# Altium schematic sheet ADC.SchDoc
size A4; SheetNumber: 13; SheetTotal: 20
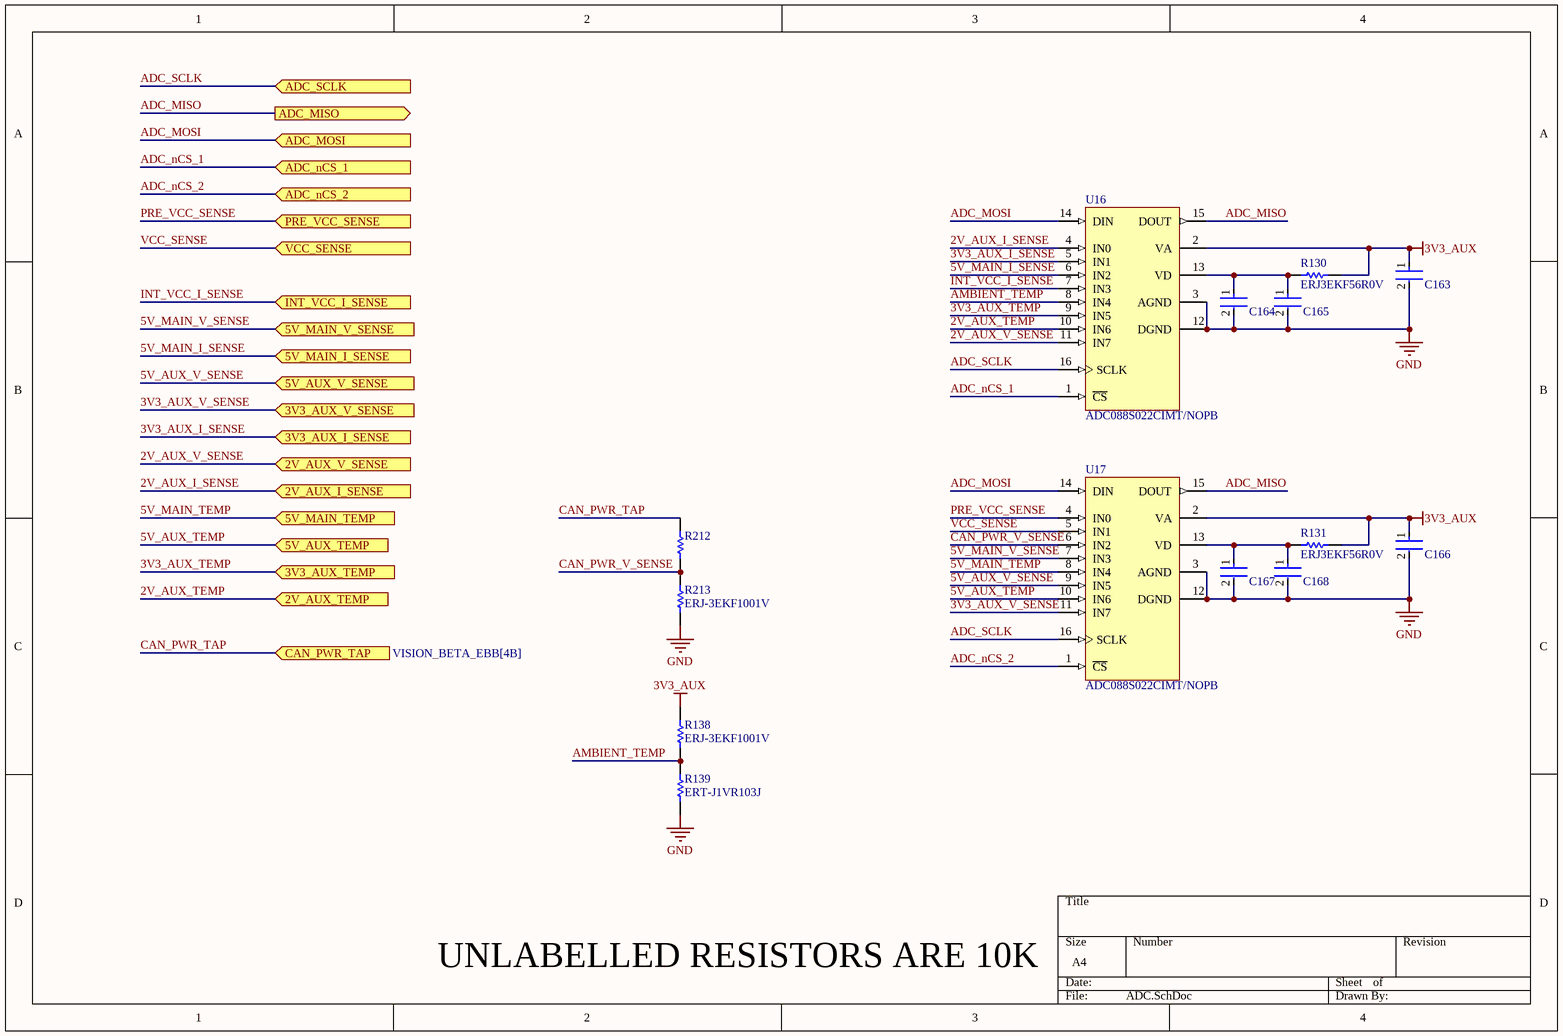
[diagram p0: ADC.SchDoc]

## Parts
C163  C0402C104K8PACTU  [FP-C0402-BB-MFG]  (value not drawn)
C164  C0402C104K8PACTU  [FP-C0402-BB-MFG]  (value not drawn)
C165  C0402C104K8PACTU  [FP-C0402-BB-MFG]  (value not drawn)
C166  C0402C104K8PACTU  [FP-C0402-BB-MFG]  (value not drawn)
C167  C0402C104K8PACTU  [FP-C0402-BB-MFG]  (value not drawn)
C168  C0402C104K8PACTU  [FP-C0402-BB-MFG]  (value not drawn)
R130  ERJ3EKF56R0V  [RESC1608X55X30NL15T15]
R131  ERJ3EKF56R0V  [RESC1608X55X30NL15T15]
R138  ERJ-3EKF1001V  [RESC1608X55X30LL15T15]
R139  ERT-J1VR103J  [RESC1608X90X30ML15T20]
R212  ERJ3EKF1002V  [RESC1609X55X30LL15T15]  (value not drawn)
R213  ERJ-3EKF1001V  [RESC1608X55X30LL15T15]
U16  ADC088S022CIMT/NOPB  [MTC16_L]
U17  ADC088S022CIMT/NOPB  [MTC16_L]

## Ports
2V_AUX_I_SENSE (in, see VISION_BETA_EBB[4B], PWR_MGMT[6A]), 2V_AUX_TEMP (in, see VISION_BETA_EBB[4B]), 2V_AUX_V_SENSE (in, see VISION_BETA_EBB[4B]), 3V3_AUX_I_SENSE (in, see VISION_BETA_EBB[4B], PWR_MGMT[6A]), 3V3_AUX_TEMP (in, see VISION_BETA_EBB[4B]), 3V3_AUX_V_SENSE (in, see VISION_BETA_EBB[4B]), 5V_AUX_TEMP (in, see VISION_BETA_EBB[4A]), 5V_AUX_V_SENSE (in, see VISION_BETA_EBB[4A]), 5V_MAIN_I_SENSE (in, see VISION_BETA_EBB[4B], PWR_MGMT[6A]), 5V_MAIN_TEMP (in, see VISION_BETA_EBB[4A]), 5V_MAIN_V_SENSE (in, see VISION_BETA_EBB[4A]), ADC_MISO (out, see VISION_BETA_EBB[5A]), ADC_MOSI (in, see VISION_BETA_EBB[5A]), ADC_nCS_1 (in, see VISION_BETA_EBB[5A]), ADC_nCS_2 (in, see VISION_BETA_EBB[5A]), ADC_SCLK (in, see VISION_BETA_EBB[5A]), CAN_PWR_TAP (in, see VISION_BETA_EBB[4B]), INT_VCC_I_SENSE (in, see VISION_BETA_EBB[4B], PWR_MGMT[6A]), PRE_VCC_SENSE (in, see VISION_BETA_EBB[4B], PWR_MGMT[6A]), VCC_SENSE (in, see VISION_BETA_EBB[4B], PWR_MGMT[6A])

## Nets
3V3_AUX: C163.1 C166.1 R130.1 R131.1 R138.2 U16.2(VA) U17.2(VA)
GND: C163.2 C164.2 C165.2 C166.2 C167.2 C168.2 R139.1 R213.1 U16.3(AGND) U16.12(DGND) U17.3(AGND) U17.12(DGND)
2V_AUX_I_SENSE: U16.4(IN0) ; port 2V_AUX_I_SENSE
2V_AUX_TEMP: U16.10(IN6) ; port 2V_AUX_TEMP
2V_AUX_V_SENSE: U16.11(IN7) ; port 2V_AUX_V_SENSE
3V3_AUX_I_SENSE: U16.5(IN1) ; port 3V3_AUX_I_SENSE
3V3_AUX_TEMP: U16.9(IN5) ; port 3V3_AUX_TEMP
3V3_AUX_V_SENSE: U17.11(IN7) ; port 3V3_AUX_V_SENSE
5V_AUX_TEMP: U17.10(IN6) ; port 5V_AUX_TEMP
5V_AUX_V_SENSE: U17.9(IN5) ; port 5V_AUX_V_SENSE
5V_MAIN_I_SENSE: U16.6(IN2) ; port 5V_MAIN_I_SENSE
5V_MAIN_TEMP: U17.8(IN4) ; port 5V_MAIN_TEMP
5V_MAIN_V_SENSE: U17.7(IN3) ; port 5V_MAIN_V_SENSE
ADC_MISO: U16.15(DOUT) U17.15(DOUT) ; port ADC_MISO
ADC_MOSI: U16.14(DIN) U17.14(DIN) ; port ADC_MOSI
ADC_nCS_1: U16.1(~{CS}) ; port ADC_nCS_1
ADC_nCS_2: U17.1(~{CS}) ; port ADC_nCS_2
ADC_SCLK: U16.16(SCLK) U17.16(SCLK) ; port ADC_SCLK
AMBIENT_TEMP: R138.1 R139.2 U16.8(IN4)
CAN_PWR_TAP: R212.2 ; port CAN_PWR_TAP
CAN_PWR_V_SENSE: R212.1 R213.2 U17.6(IN2)
INT_VCC_I_SENSE: U16.7(IN3) ; port INT_VCC_I_SENSE
PRE_VCC_SENSE: U17.4(IN0) ; port PRE_VCC_SENSE
VCC_SENSE: U17.5(IN1) ; port VCC_SENSE
NetC164_1: C164.1 C165.1 R130.2 U16.13(VD)
NetC167_1: C167.1 C168.1 R131.2 U17.13(VD)

## Notes on the sheet
- UNLABELLED RESISTORS ARE 10K

## Library data of the parts
C163-C168 = CMP-2008-02046-2: CAP CER 0.1UF 10V X5R 0402; Manufacturer: Kemet; Material: Ceramic; Capacitance: 0.10 μF; Temperature Coefficient: 15%; Tolerance: 0.1; Value: 0.10 μF; Package: C0402-BB; Temperature: -55°C to +125°C; ComponentLink2Description: Datasheet; Temperature Characteristic: X5R; Device Class L1: Passive Components; Height: 0.55mm; Lead Free: Yes; ComponentLink2URL: https://content.kemet.com/datasheets/KEM_C1002_X7R_SMD.pdf; Device Class L2: Capacitors; Temperature Range Low: -55°C; Temperature Range High: +125°C; RoHS: TRUE; Octopart: https://octopart.com/c0402c104k8pactu-kemet-140039; Automotive: No; Mouser Description: Capacitor 100 nF 10 VDC 0402; Category: Cap; Voltage Rating: 10 V; Digikey Description: CAP CER 0.1UF 10V X5R 0402; Ipc Land Pattern Name: CAPC10050X50; Device Class L3: Ceramic Capacitors; Manufacturer Part Number: C0402C104K8PACTU
R130 R131 = CMP-2000-00572-1: Manufacturer: Panasonic; Part Number: ERJ3EKF56R0V
R138 R213 = CMP-2000-00180-1: Manufacturer: Panasonic; Part Number: ERJ-3EKF1001V
R139 = CMP-2000-00869-1: Manufacturer: Panasonic; Part Number: ERT-J1VR103J
R212 = CMP-1012-00623-3: Chip Resistor, 10 KOhm, +/- 1%, 0.1 W, -55 to 155 degC, 0603 (1608 Metric), RoHS, Tape and Reel; Manufacturer: Panasonic; Voltage Rating: 75V; Case\/Package: 0603; Power Rating: 100mW; Resistance: 10KOhm; Temperature Coefficient: 100ppm\/degreesC; Number of Pins: 2; Package Reference: 603; Depth: 0.8mm; Mount: SurfaceMount; Package Description: 2-Pin Surface Mount Device, Body 1.6 x 0.85 mm; Datasheet Version: 02/2017; Length: 1.6mm; Lead Free: LeadFree; Height: 0.45mm; Number of Terminations: 2; Max Power Dissipation: 100mW; Min Operating Temperature: -55degC; Datasheet URL: https://industrial.panasonic.com/cdbs/www-data/pdf/RDA0000/AOA0000C304.pdf; Termination: SMD/SMT; Case Code (Metric): 1608; Case Code (Imperial): 0603; Tolerance: 1%; Max Operating Temperature: 155degC; RoHSCompliant: true; Voltage Rating (DC): 75V; Radiation Hardening: No; Packaging: TapeandReel; Composition: ThickFilm; Mounting Technology: SurfaceMount; Manufacturer URL: http://www.panasonic.com/; Width: 0.031inch; REACH SVHC: NoSVHC; Contact Plating: Tin; Military Standard: Not; Package Quantity: 1
U16 U17 = CMP-0054-00372-2: 8-Channel, 50 kSPS to 200 kSPS, 8-Bit A/D Converter, 16-pin TSSOP, Pb-Free; Manufacturer: National Semiconductor; PackageTopMarking: NSUZXYTT*88S022*CIMT; CompType: ADC IC; PowerWise: Y; ComponentLink2URL: http://www.national.com/pf/AD/ADC088S022.html; RoHS: Y; PackageDescription: Molded TSSOP, Jedec, 5 x 4.4 x 0.9mm Body, 16 Lead, 0.65mm Pitch; DatasheetVersion: Feb-2010; PinCount: 16; ComponentLink1Description: ADC088S022 Datasheet; Code_JEDEC: MO-153-AB; ComponentLink3URL: http://www.national.com/packaging/folders/mtc16.html; PackageVersion: revD, Jun-2003; ComponentLink3Description: MTC16 Package Page; RevisionNote: Component URLs added; ComponentLink1URL: http://www.national.com/ds/AD/ADC088S022.pdf; ComponentLink2Description: ADC088S022 Web Page; PackageReference: MTC16